# Altium schematic sheet Display.SchDoc: LCD Display
size 420 x 297 mm; ENG_APP_DATE: --/--/--; DSN_APP_DATE: --/--/--; CHK_APP_DATE: --/--/--
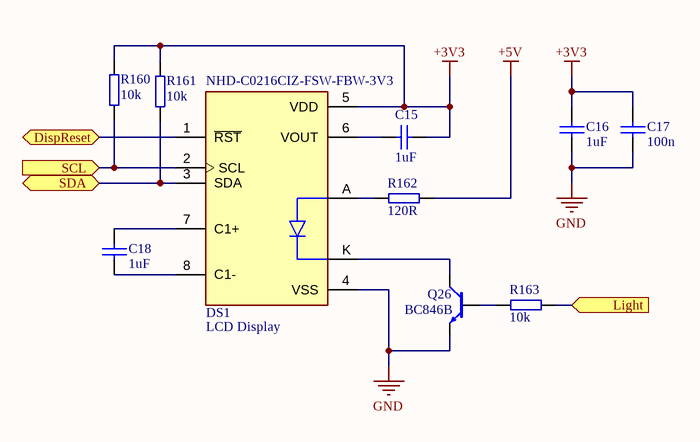
[diagram p0: Display.SchDoc]

## Parts
C15  Name: 1uF  [C_0603]  (hidden comment: 1uF_35V)
C16  Name: 1uF  [C_0805]  (hidden comment: 1uF_35V)
C17  Name: 100n  [C_0805]  (hidden comment: 100nF_35V)
C18  Name: 1uF  [C_0603]  (hidden comment: 1uF_35V)
DS1  MP: NHD-C0216CIZ-FSW-FBW-3V3  Name: LCD Display  [LCD_NHD-C0216CIZ-FSW-FBW-3V3]  (hidden comment: LCD_FSTN_Display)
Q26  Name: BC846B  [NPN_BJT_SOT23]  (hidden comment: BC846B_SOT23)
R160  Name: 10k  [R_0805]  (hidden comment: 10k_125mW)
R161  Name: 10k  [R_0805]  (hidden comment: 10k_125mW)
R162  Name: 120R  [R_0805]  (hidden comment: 120R_125mW)
R163  Name: 10k  [R_0805]  (hidden comment: 10k_125mW)

## Ports
DispReset (bidir), Light (in), SCL (in), SDA (bidir)

## Nets
+3V3: C15.2 C16.2 C17.2 DS1.5(VDD) R160.1 R161.1
+5V: R162.1
GND: C16.1 C17.1 DS1.4(VSS) Q26.3(E)
DispReset: DS1.1(~{RST}) ; port DispReset
Light: R163.1 ; port Light
SCL: DS1.2(SCL) R160.2 ; port SCL
SDA: DS1.3(SDA) R161.2 ; port SDA
NetC15_1: C15.1 DS1.6(VOUT)
NetC18_1: C18.1 DS1.8(C1-)
NetC18_2: C18.2 DS1.7(C1+)
NetDS1_A: DS1.A R162.2
NetDS1_K: DS1.K Q26.1(C)
NetQ26_2: Q26.2(B) R163.2

## Notes on the sheet
- THIS DOCUMENT AND THE DATA DISCLOSED HEREIN OR
- HEREWITH IS THE PROPERTY OF ALTIUM LIMITED AND MAY
- DWG NO:
- REVISION
- REV:
- DESCRIPTION
- DATE
- APPROVED
- BE FREELY DISTRIBUTED IN WHOLE. NO RIGHTS ARE
- RESERVED OR EXPRESS OR IMPLIED WARANTEE GIVEN.
- ENG:
- APPROVALS
- PROJECT
- DSN:
- CHK:
- REFERENCE DOCUMENTS
- PROJECT REVISION:
- TITLE
- DOCUMENT REVISION:
- DESIGN ITEM:
- BOM:
- FAB DWG:
- PCB DWG:
- ASSY DWG:
- SCALE:
- A3
- SIZE
- CAGE CODE
- FILE NAME
- DWG NO.
- SHEET
- OF
- REV

## Library data of the parts
C15 C18 = C_1uF_0603: Capacitor [SMD]; Manufacturer: Murata; Manufacturer Part Number: GRT188R61H105KE13D; Dielectric: X5R; Tolerance: 10%; Voltage Rating: 50V; ComponentLink1Description: DATASHEET; ComponentLink1URL: https://hr.mouser.com/datasheet/2/281/1/GRT188R61H105KE13_01-1989463.pdf; ComponentLink2Description: BUY; ComponentLink2URL: https://hr.mouser.com/ProductDetail/Murata-Electronics/GRT188R61H105KE13D?qs=drgMNd%252BkGPNIxxtJByMGCg%3D%3D; Capacitance: 1uF; Case Code (Imperial): 0603; Case Code (Metric): 1608; Case/Package: 0603; Length: 0.063inch; Max Operating Temperature: 85°C; Min Operating Temperature: -55°C; Mount: Surface Mount; Packaging: Tape and Reel; Ratings: AEC-Q200; RoHS Compliant: Yes; Thickness: 0.035inch; Voltage Rating (DC): 50V; Width: 0.031inch; Supplier 1: Mouser; Supplier Part Number 1: 81-GRT188R61H105KE3D
C16 = C_1uF_0805: Capacitor [SMD]; Manufacturer: Murata; Manufacturer Part Number: GCJ21BR71H105KA01L; Dielectric: X7R; Tolerance: 10%; Voltage Rating: 50V; ComponentLink1Description: DATASHEET; ComponentLink1URL: https://hr.mouser.com/datasheet/2/281/GCJ21BR71H105KA01_01-1963894.pdf; ComponentLink2Description: BUY; ComponentLink2URL: https://hr.mouser.com/ProductDetail/Murata-Electronics/GCJ21BR71H105KA01L?qs=hNud%2FORuBR3CJcLH9kX5%252Bw%3D%3D; Supplier 1: Mouser; Supplier Part Number 1: 81-GCJ21BR71H105KA1L; Capacitance: 1uF; Case Code (Imperial): 0805; Case Code (Metric): 2012; Case/Package: 0805; Features: Soft Termination; Height: 1.25mm; Lead Free: Lead Free; Length: 0.079inch; Max Operating Temperature: 125°C; Min Operating Temperature: -55°C; Mount: Surface Mount; Package Quantity: 3000; Packaging: Tape and Reel; Ratings: AEC-Q200; RoHS Compliant: Yes; Termination: SMD/SMT; Thickness: 0.057inch; Voltage Rating (DC): 50V; Weight: 0.000335oz; Width: 0.049inch; Supplier Packaging 1: Tape & Reel; Supplier Unit Price 1: $0.32; Supplier Location 1: US
C17 = C_100nF_0805: Capacitor [SMD]; Manufacturer: Murata; Manufacturer Part Number: GCJ21BL81H104KA01L; Capacitance: 100nF; Tolerance: 10%; Voltage Rating: 50V; ComponentLink1Description: DATASHEET; ComponentLink1URL: https://hr.mouser.com/datasheet/2/281/GCJ21BL81H104KA01_01-1963909.pdf; ComponentLink2Description: BUY; ComponentLink2URL: https://hr.mouser.com/ProductDetail/Murata-Electronics/GCJ21BL81H104KA01L?qs=QzBtWTOodeX5ICEuC%252Bh33g%3D%3D; Supplier 1: Mouser; Supplier Part Number 1: 81-GCJ21BL81H104KA1L; Case Code (Imperial): 0805; Case Code (Metric): 2012; Case/Package: 0805; Features: Soft Termination; Max Operating Temperature: 150°C; Min Operating Temperature: -55°C; Mount: Surface Mount; Packaging: Tape and Reel; Ratings: AEC-Q200; RoHS Compliant: Yes; Supplier Packaging 1: Tape & Reel; Supplier Unit Price 1: $0.30; Supplier Location 1: US
DS1 = LCD_FSTN_Display: NHD-C0216CIZ-FSW-FBW-3V3 / LCD Display; Manufacturer: Newhaven Display; MF: Newhaven; Background Color: White; Backlight Type: LED; Contrast Ratio: 6:1; Interface: I2C; Number of Characters: 32; Operating Supply Voltage: 3V; SnapEDA_Link: https://www.snapeda.com/parts/NHD-C0216CIZ-FSW-FBW-3V3/Newhaven%20Display%20Intl/view-part/1660867/?ref=snap; Value: *; Digi-Key_Part_Number: NHD-C0216CIZ-FSW-FBW-3V3-ND; Digi-Key_Purchase_URL: https://www.digikey.com/product-detail/en/newhaven-display-intl/NHD-C0216CIZ-FSW-FBW-3V3/NHD-C0216CIZ-FSW-FBW-3V3-ND/2165872?utm_source=snapeda&utm_medium=aggregator&utm_campaign=symbol; Package: None; ComponentLink1Description: DATASHEET; ComponentLink1URL: https://hr.mouser.com/datasheet/2/291/NHD_C0216CiZ_FSW_FBW_3V3-2904729.pdf; ComponentLink2Description: BUY; ComponentLink2URL: https://hr.mouser.com/ProductDetail/Newhaven-Display/NHD-C0216CiZ-FSW-FBW-3V3?qs=Vb5qD4CGh4kMzks2c1g3mA%3D%3D; Supplier 1: Mouser; Supplier Part Number 1: 763-C0216CIZFSWFBW3V; Max Operating Temperature: 70°C; Min Operating Temperature: -20°C; Mount: Through Hole; Number of Pins: 8; Package Quantity: 100; Packaging: Bulk; Supplier Packaging 1: Bulk; Supplier Unit Price 1: $16.00; Supplier Location 1: US; Manufacturer Part Number: NHD-C0216CIZ-FSW-FBW-3V3
Q26 = BC846B_SOT23: NPN transistor [SMD]; Manufacturer Part Number: BC846ALT1G; Manufacturer: ON Semiconductor; Collector Base Voltage (VCBO): 80V; Collector Emitter Breakdown Voltage: 65V; Collector Emitter Saturation Voltage: 600mV; Current Rating: 100mA; Element Configuration: Single; Emitter Base Voltage (VEBO): 6V; Frequency: 100MHz; hFE Min: 110; Max Power Dissipation: 300mW; Number of Elements: 1; ComponentLink1Description: DATASHEET; ComponentLink1URL: https://hr.mouser.com/datasheet/2/308/1/BC846ALT1_D-2310268.pdf; ComponentLink2Description: BUY; ComponentLink2URL: https://hr.mouser.com/ProductDetail/onsemi/BC846ALT1G?qs=vNc2DXHODiKaYXYnVvJi5w%3D%3D; Case/Package: SOT-23; Collector Emitter Voltage (VCEO): 65V; Collector-emitter Voltage-Max: 600mV; Contact Plating: Tin,Matte; Gain Bandwidth Product: 100MHz; Halogen Free: Halogen Free; Height: 0.94mm; Lead Free: Lead Free; Length: 2.9mm; Max Breakdown Voltage: 65V; Max Collector Current: 100mA; Max Frequency: 100MHz; Max Operating Temperature: 150°C; Min Operating Temperature: -55°C; Number of Pins: 3; Package Quantity: 1; Packaging: Tape and Reel; Polarity: NPN; Power Dissipation: 300mW; Radiation Hardening: No; REACH SVHC: No SVHC; RoHS Compliant: Yes; Series: BC846AL; Transition Frequency: 100MHz; Voltage Rating (DC): 65V; Width: 1.3mm; Supplier 1: Mouser; Supplier Part Number 1: 863-BC846ALT1G
R160 R161 R163 = R_10k_0805: Resistor [SMD]; Manufacturer: Vishay; Manufacturer Part Number: CRCW080510K0FKEAC; Power Rating: 125mW; Resistance: 10000R; Tolerance: 1%; ComponentLink1Description: DATASHEET; ComponentLink1URL: https://hr.mouser.com/datasheet/2/427/crcwce3-1762584.pdf; ComponentLink2Description: BUY; ComponentLink2URL: https://hr.mouser.com/ProductDetail/Vishay-Dale/CRCW080510K0FKEAC?qs=E3Y5ESvWgWORadmUijPtxQ%3D%3D; Supplier 1: Mouser; Supplier Part Number 1: 71-CRCW080510K0FKEAC; Case/Package: 0805; Lead Free: Lead Free; RoHS Compliant: Yes; Supplier Packaging 1: Tape & Reel; Supplier Unit Price 1: $0.10; Supplier Location 1: US
R162 = R_120R_0805: Resistor [SMD]; Manufacturer: Vishay; Manufacturer Part Number: CRCW0805120RFKEAC; Max Power Dissipation: 125mW; Temperature Coefficient: 100ppm/°C; Tolerance: 1%; ComponentLink1Description: DATASHEET; ComponentLink1URL: https://hr.mouser.com/datasheet/2/427/crcwce3-1762584.pdf; ComponentLink2Description: BUY; ComponentLink2URL: https://hr.mouser.com/ProductDetail/Vishay-Dale/CRCW0805120RFKEAC?qs=sGAEpiMZZMtlubZbdhIBIIZe04wfiaJWafdARitYaZA%3D; Supplier 1: Mouser; Supplier Part Number 1: 71-CRCW0805120RFKEAC; Case/Package: 0805; Max Operating Temperature: 155°C; Min Operating Temperature: -55°C; Number of Terminations: 2; Packaging: Tape and Reel; Resistance: 120R; Resistor Type: Thick Film; RoHS Compliant: Yes; Supplier Packaging 1: Tape & Reel; Supplier Unit Price 1: $0.12; Supplier Location 1: US